# Altium schematic sheet Control.SchDoc
size A
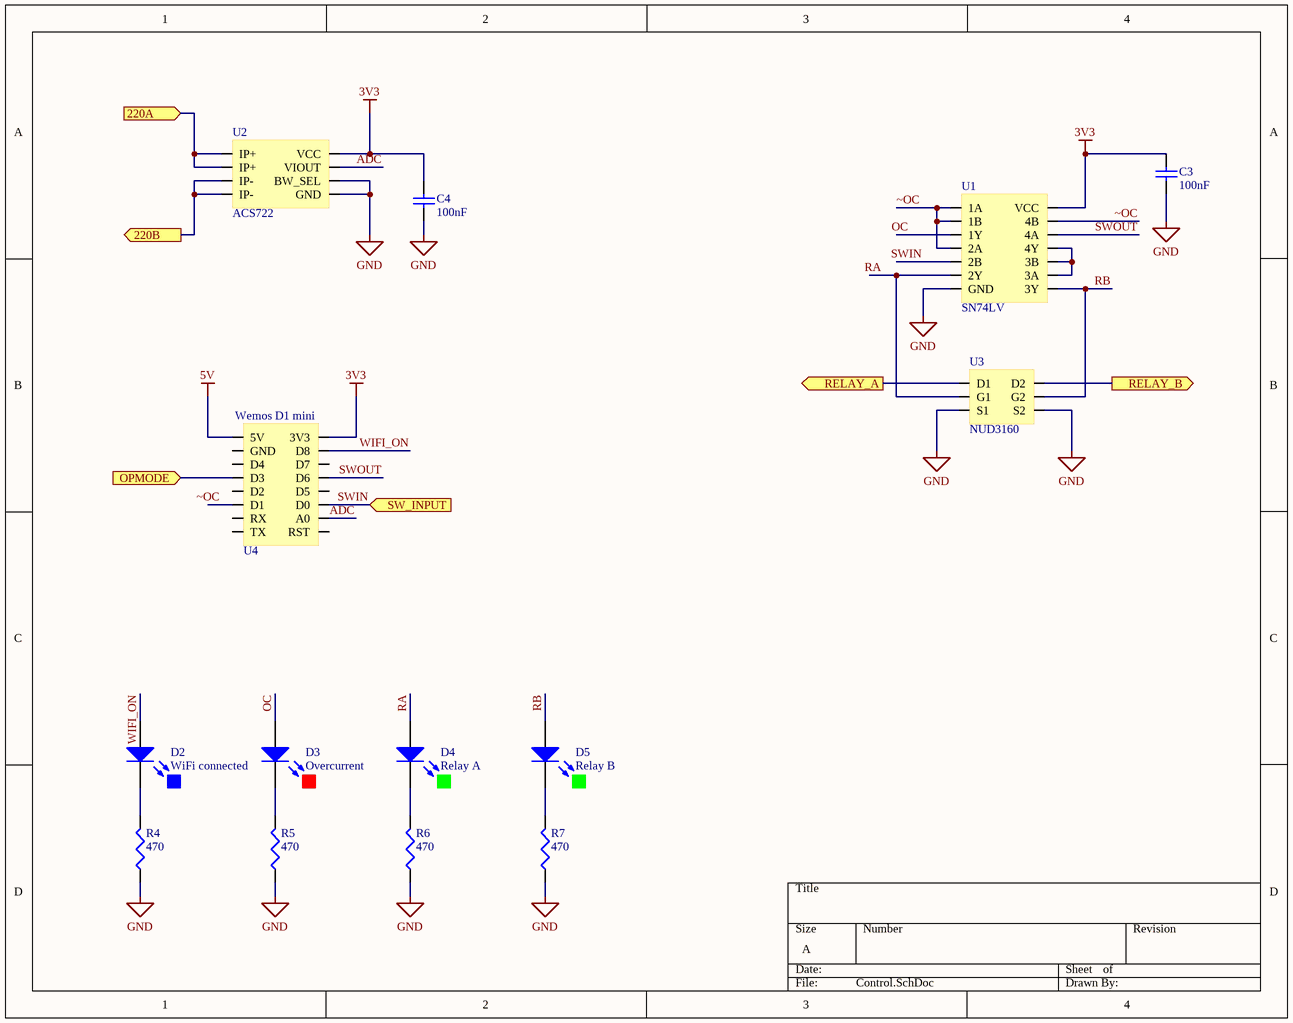
[diagram p0: Control.SchDoc]

## Parts
C3  value 100nF  [C0805]  (hidden comment: Cap)
C4  value 100nF  [C0805]  (hidden comment: Cap)
D2  WiFi connected  [3.2X1.6X1.1]
D3  Overcurrent  [3.2X1.6X1.1]
D4  Relay A  [3.2X1.6X1.1]
D5  Relay B  [3.2X1.6X1.1]
R4  value 470  [J1-0603]  (hidden comment: Res3)
R5  value 470  [J1-0603]  (hidden comment: Res3)
R6  value 470  [J1-0603]  (hidden comment: Res3)
R7  value 470  [J1-0603]  (hidden comment: Res3)
U1  SN74LV  [TSSOP14]
U2  ACS722  [SOIC8]
U3  NUD3160  [SC-74]
U4  Wemos D1 mini  [WEMOS_D1]

## Ports
220A (in), 220B (out), OPMODE (in), RELAY_A (out), RELAY_B (out), SW_INPUT (in)

## Nets
3V3: C3.2 C4.2 U1.14(VCC) U2.8(VCC) U4.16(3V3)
5V: U4.1(5V)
GND: C3.1 C4.1 R4.1 R5.1 R6.1 R7.1 U1.7(GND) U2.5(GND) U2.6(BW_SEL) U3.1(S1) U3.4(S2)
220A: U2.1(IP+) U2.2(IP+) ; port 220A
220B: U2.3(IP-) U2.4(IP-) ; port 220B
ADC: U2.7(VIOUT) U4.10(A0)
OC: D3.1(A) U1.3(1Y)
OPMODE: U4.4(D3) ; port OPMODE
RA: D4.1(A) U1.6(2Y) U3.2(G1)
RB: D5.1(A) U1.8(3Y) U3.5(G2)
RELAY_A: U3.6(D1) ; port RELAY_A
RELAY_B: U3.3(D2) ; port RELAY_B
SWIN: U1.5(2B) U4.11(D0) ; port SW_INPUT
SWOUT: U1.12(4A) U4.13(D6)
WIFI_ON: D2.1(A) U4.15(D8)
~OC: U1.1(1A) U1.2(1B) U1.4(2A) U1.13(4B) U4.6(D1)
NetD2_2: D2.2(K) R4.2
NetD3_2: D3.2(K) R5.2
NetD4_2: D4.2(K) R6.2
NetD5_2: D5.2(K) R7.2
NetU1_9: U1.9(3A) U1.10(3B) U1.11(4Y)

Not connected (* = marked no-connect by the designer): U4 2(GND) 3(D4) 5(D2) 7(RX) 8(TX) 9(RST) 12(D5) 14(D7)

## Library data of the parts
C3 C4 = Cap: Capacitor; Manufacturer 1: KEMET; Manufacturer Part Number 1: C0805C104Z5VACTU; Description 1: KEMET         C0805C104Z5VACTU.             CERAMIC CAPACITOR, 0.1UF, 50V, Y5V, +80,-20%, 0805; Dielectric Material: Ceramic; Voltage Rating: 50V; Tolerance: 80%; Dielectric: Y5V; Dissipation Factor: 5%; Published: 8-Jun-2000; LatestRevisionDate: 17-Jul-2002; LatestRevisionNote: Re-released for DXP Platform.; PackageReference: RAD-0.3; Publisher: Altium Limited; PackageDescription: Radial Cap, Thru-Hole; 2 Leads; 0.3 in Pin Spacing; Supplier 1: Digi-Key; Supplier Part Number 1: 399-1177-6-ND; Stock: 978536; Pricing 1: 1=0.1, 10=0.057, 100=0.0254, 500=0.01818, 1000=0.01428 (USD); Mount: Surface Mount,PCB; Case/Package: 0805; Number of Pins: 2; Case Code (Metric): 2012; Case Code (Imperial): 0805; Min Operating Temperature: -30°C; Max Operating Temperature: 85°C; Package Quantity: 1; Capacitance: 100nF; Packaging: Tape and Reel; Voltage Rating (DC): 50V; Termination: SMD/SMT; Voltage: 50V; Length: 2mm; Height: 0.9mm; Lead Pitch: 0.75mm; Width: 0.049inch; Thickness: 0.039inch; Depth: 1.25mm; Radiation Hardening: No; REACH SVHC: No SVHC; Lead Free: Lead Free; ComponentLink1URL: http://www.alliedelec.com/m/d/9bfe7773041ffe9d406e68bc7b377fdd.pdf?src-supplier=Allied+Electronics; ComponentLink1Description: http://www.alliedelec.com/m/d/9bfe7773041ffe9d406e68bc7b377fdd.pdf?src-supplier=Allied+Electronics; ComponentLink2URL: https://www.verical.com/server-webapp/html/getDatasheet?partID=37101&src-supplier=Verical; ComponentLink2Description: https://www.verical.com/server-webapp/html/getDatasheet?partID=37101&src-supplier=Verical; ComponentLink3URL: https://www.verical.com/server-webapp/html/getDatasheet?partID=321176&src-supplier=Verical; ComponentLink3Description: https://www.verical.com/server-webapp/html/getDatasheet?partID=321176&src-supplier=Verical; ComponentLink4URL: http://www.farnell.com/datasheets/2123124.pdf?src-supplier=Element14; ComponentLink4Description: http://www.farnell.com/datasheets/2123124.pdf?src-supplier=Element14
D2-D5 = LED2: Typical RED, GREEN, YELLOW, AMBER GaAs LED; Manufacturer 1: Stanley; Manufacturer Part Number 1: BR1101W-TR; Description 1: Red 1206 152/141° 12.8 mcd Clear 1.7 V LED Surface Mount; Lens Style: Clear; Forward Voltage: 1.7V; Viewing Angle: 141°; Wavelength: 660nm; Luminous Intensity: 12.8mcd; Published: 8-Jun-2000; LatestRevisionDate: 17-Jul-2002; LatestRevisionNote: Re-released for DXP Platform.; PackageVersion: Feb-2002; PackageReference: 3.2X1.6X1.1; Publisher: Altium Limited; PackageDescription: SM LED; 2 Flat Leads; Supplier 1: Digi-Key; Supplier Part Number 1: 404-1042-6-ND; Stock: 56287; Pricing 1: 1=0.47, 10=0.334, 100=0.195, 500=0.13368, 1000=0.1114 (USD); Mount: Surface Mount; Case/Package: 1206; Color: Red; Packaging: Cut Tape; Length: 3mm; Height: 1.5mm; Width: 1.5mm; Lead Free: Lead Free; ComponentLink1URL: http://www1.futureelectronics.com/doc/STANLEY/BR1101W-TR.pdf?src-supplier=Future+Electronics; ComponentLink1Description: http://www1.futureelectronics.com/doc/STANLEY/BR1101W-TR.pdf?src-supplier=Future+Electronics
R4-R7 = Res3: Resistor; Manufacturer 1: TE Connectivity; Manufacturer Part Number 1: CRGCQ0603J470R; Description 1: TE CONNECTIVITY - CRGCQ0603J470R - RES, 470R, 5%, 0603, THICK FILM; Resistance: 470R; Tolerance: 5%; Max Power Dissipation: 100mW; Temperature Coefficient: 100ppm/°C; Published: 8-Jun-2000; LatestRevisionDate: 29-May-2009; LatestRevisionNote: IPC-7351 Footprint Added.; PackageReference: J1-0603; Publisher: Altium Limited; PackageDescription: Chip Resistor; Supplier 1: Digi-Key; Supplier Part Number 1: A130089DKR-ND; Stock: 87954; Pricing 1: 1=0.1, 10=0.021, 100=0.0086, 1000=0.00387, 2500=0.00336 (USD); Case/Package: 0603; Case Code (Imperial): 0603; Case Code (Metric): 1608; Min Operating Temperature: -55°C; Max Operating Temperature: 155°C; Composition: Thick Film; Features: Moisture Resistant,Automotive AEC-Q200; Packaging: Tape and Reel; Number of Terminations: 2; ComponentLink1URL: https://4donline.ihs.com/images/VipMasterIC/IC/TYEL/TYEL-S-A0004929575/TYEL-S-A0004929575-1.pdf?hkey=52A5661711E402568146F3353EA87419&src-supplier=Farnell; ComponentLink1Description: https://4donline.ihs.com/images/VipMasterIC/IC/TYEL/TYEL-S-A0004929575/TYEL-S-A0004929575-1.pdf?hkey=52A5661711E402568146F3353EA87419&src-supplier=Farnell; ComponentLink2URL: https://4donline.ihs.com/images/VipMasterIC/IC/TYEL/TYEL-S-A0004929575/TYEL-S-A0004929575-1.pdf?hkey=52A5661711E402568146F3353EA87419&src-supplier=Newark; ComponentLink2Description: https://4donline.ihs.com/images/VipMasterIC/IC/TYEL/TYEL-S-A0004929575/TYEL-S-A0004929575-1.pdf?hkey=52A5661711E402568146F3353EA87419&src-supplier=Newark; ComponentLink3URL: https://www.te.com/commerce/DocumentDelivery/DDEController?Action=srchrtrv&amp;DocNm=1773204-3&amp;DocType=DS&amp;DocLang=English&src-supplier=Digi-Key; ComponentLink3Description: https://www.te.com/commerce/DocumentDelivery/DDEController?Action=srchrtrv&amp;DocNm=1773204-3&amp;DocType=DS&amp;DocLang=English&src-supplier=Digi-Key; ComponentLink4URL: https://www.te.com/commerce/DocumentDelivery/DDEController?Action=srchrtrv&DocNm=1773204-3&DocType=DS&DocLang=English&src-supplier=Digi-Key; ComponentLink4Description: https://www.te.com/commerce/DocumentDelivery/DDEController?Action=srchrtrv&DocNm=1773204-3&DocType=DS&DocLang=English&src-supplier=Digi-Key
U1 = SN74LVC00APWR: IC GATE NAND 4CH 2-INP 14-SSOP; Manufacturer 1: Texas Instruments; Description 1: IC GATE NAND 4CH 2-INP 14TSSOP; Propagation Delay: 4.1ns; Min Supply Voltage: 1.65V; Max Supply Voltage: 3.6V; Number of Elements: 4; Turn-On Delay Time: 4.3ns; Number of Inputs: 2; Number of Outputs: 1; Output Current: 24mA; Quiescent Current: 1uA; High Level Output Current: -24mA; Schmitt Trigger Input: No; Supplier 1: Digi-Key; Supplier Part Number 1: 296-1216-6-ND; Manufacturer Part Number 1: SN74LVC00APWR; Stock: 19024; Pricing 1: 1=0.41, 10=0.308, 100=0.1918, 500=0.13122, 1000=0.10094 (USD); Mount: Surface Mount; Case/Package: TSSOP; Number of Pins: 14; Weight: 0.002018oz; Contact Plating: Gold; Min Operating Temperature: -40°C; Max Operating Temperature: 125°C; Package Quantity: 1; Packaging: Tape and Reel; Logic Function: NAND; Number of Bits: 4; Number of Gates: 4; Number of Circuits: 4; Low Level Output Current: 24mA; Number of Input Lines: 2; Number of Output Lines: 1; Max Output Current: 24mA; Termination: SMD/SMT; Length: 5mm; Height: 1.15mm; Width: 4.4mm; Radiation Hardening: No; Lead Free: Lead Free; REACH SVHC: No SVHC; ComponentLink1URL: http://www.ti.com/lit/ds/symlink/sn74lvc00a.pdf?src-supplier=Digi-Key; ComponentLink1Description: http://www.ti.com/lit/ds/symlink/sn74lvc00a.pdf?src-supplier=Digi-Key; ComponentLink2URL: http://www.ti.com/general/docs/lit/getliterature.tsp?genericPartNumber=SN54LVC00A&&fileType=pdf&src-supplier=Avnet; ComponentLink2Description: http://www.ti.com/general/docs/lit/getliterature.tsp?genericPartNumber=SN54LVC00A&&fileType=pdf&src-supplier=Avnet; ComponentLink3URL: http://www.ti.com/general/docs/lit/getliterature.tsp?genericPartNumber=SN74LVC00A&amp;&amp;fileType=pdf&src-supplier=Newark; ComponentLink3Description: http://www.ti.com/general/docs/lit/getliterature.tsp?genericPartNumber=SN74LVC00A&amp;&amp;fileType=pdf&src-supplier=Newark; ComponentLink4URL: http://www.farnell.com/datasheets/1764343.pdf?src-supplier=Element14; ComponentLink4Description: http://www.farnell.com/datasheets/1764343.pdf?src-supplier=Element14; ComponentLink5URL: http://www.farnell.com/datasheets/2018849.pdf?src-supplier=Element14; ComponentLink5Description: http://www.farnell.com/datasheets/2018849.pdf?src-supplier=Element14; ComponentLink6URL: http://www.produktinfo.conrad.com/datenblaetter/1000000-1099999/001017089-da-01-en-IC_QUA_2IN_PO_SN74LVC00APWR_TSSOP_14_TID.pdf?src-supplier=Conrad; ComponentLink6Description: http://www.produktinfo.conrad.com/datenblaetter/1000000-1099999/001017089-da-01-en-IC_QUA_2IN_PO_SN74LVC00APWR_TSSOP_14_TID.pdf?src-supplier=Conrad
U2 = ACS722LLCTR-20AB-T: SENSOR CURRENT HALL 20A AC/DC; Manufacturer 1: Allegro MicroSystems; Number of Channels: 1; Frequency: 80kHz; Response Time: 5us; Max Supply Current: 12mA; Polarity: Bidirectional; Max Input Voltage: 3.6V; Min Input Voltage: 3V; Linearity: 1%; Accuracy: 3%; Quiescent Current: 9mA; Sensitivity: 66mV/A; Supplier 1: Digi-Key; Supplier Part Number 1: 620-1637-6-ND; Manufacturer Part Number 1: ACS722LLCTR-20AB-T; Description 1: SENSOR CURRENT HALL 20A AC/DC; Stock: 4729; Pricing 1: 1=4.91, 5=4.332, 10=3.827, 25=3.1052, 50=2.7442, 100=2.672, 500=2.23866, 1000=2.09424 (USD); Case/Package: SOIC; Number of Pins: 8; Packaging: Tape and Reel; Bandwidth: 80kHz; Current Sensing: 20A; Length: 4.9mm; Height: 1.5mm; Width: 3.9mm; ComponentLink1URL: https://www.allegromicro.com/~/media/Files/Datasheets/ACS722-Datasheet.ashx?src-supplier=Digi-Key; ComponentLink1Description: https://www.allegromicro.com/~/media/Files/Datasheets/ACS722-Datasheet.ashx?src-supplier=Digi-Key; ComponentLink2URL: http://www.allegromicro.com/~/media/Files/Datasheets/ACS722-Datasheet.ashx?src-supplier=Digi-Key; ComponentLink2Description: http://www.allegromicro.com/~/media/Files/Datasheets/ACS722-Datasheet.ashx?src-supplier=Digi-Key
U3 = NUD3160DMT1G: IC INDCT LOAD DRVR INDUST SC74-6; Manufacturer 1: ON Semiconductor; Number of Outputs: 2; Max Supply Voltage: 60V; Rise Time: 600ns; Interface: On/Off; Max Output Current: 150mA; Gate to Source Voltage (Vgs): 12V; Power Dissipation: 380mW; Output Configuration: Low Side; Output Current: 200mA; Output Voltage: 61V; Current Rating: 263mA; Drain to Source Resistance: 1.8R; Element Configuration: Dual; On-State Resistance: 3.7R; Supplier 1: Digi-Key; Supplier Part Number 1: NUD3160DMT1GOSDKR-ND; Manufacturer Part Number 1: NUD3160DMT1G; Description 1: IC INDCT LOAD DRVR INDUST SC74-6; Stock: 11786; Pricing 1: 1=0.45, 10=0.367, 100=0.2264, 500=0.17176, 1000=0.12882 (USD); Mount: Surface Mount; Case/Package: SC; Number of Pins: 6; Contact Plating: Tin,Matte; Min Operating Temperature: -40°C; Max Operating Temperature: 125°C; Packaging: Tape and Reel; Package Quantity: 3000; Continuous Drain Current (ID): 150mA; Fall Time: 600ns; Number of Elements: 2; Drain to Source Breakdown Voltage: 60V; Drain to Source Voltage (Vdss): 60V; Length: 3mm; Height: 0.94mm; Width: 1.5mm; Radiation Hardening: No; Lead Free: Lead Free; Halogen Free: Halogen Free; REACH SVHC: No SVHC; ComponentLink1URL: http://www.onsemi.com/pub_link/Collateral/NUD3160-D.PDF?src-supplier=Digi-Key; ComponentLink1Description: http://www.onsemi.com/pub_link/Collateral/NUD3160-D.PDF?src-supplier=Digi-Key; ComponentLink2URL: http://www.onsemi.ru.com/pub/Collateral/NUD3160-D.PDF?src-supplier=Avnet+Europe; ComponentLink2Description: http://www.onsemi.ru.com/pub/Collateral/NUD3160-D.PDF?src-supplier=Avnet+Europe; ComponentLink3URL: http://www.onsemi.com/pub/Collateral/NUD3160-D.PDF?src-supplier=Digi-Key; ComponentLink3Description: http://www.onsemi.com/pub/Collateral/NUD3160-D.PDF?src-supplier=Digi-Key; ComponentLink4URL: http://www.onsemi.cn/pub_link/Collateral/NUD3160-D.PDF?src-supplier=Avnet; ComponentLink4Description: http://www.onsemi.cn/pub_link/Collateral/NUD3160-D.PDF?src-supplier=Avnet; ComponentLink5URL: http://www.onsemi.ru.com/pub/Collateral/NUD3160-D.PDF?src-supplier=Avnet; ComponentLink5Description: http://www.onsemi.ru.com/pub/Collateral/NUD3160-D.PDF?src-supplier=Avnet
U4 = ESP8266: ESP8266 based MCU with Wi-Fi; Manufacturer Part Number 1: D1 mini; Manufacturer 1: Wemos; ComponentLink1Description: Datasheet; ComponentLink1URL: https://docs.wemos.cc/en/latest/d1/d1_mini.html